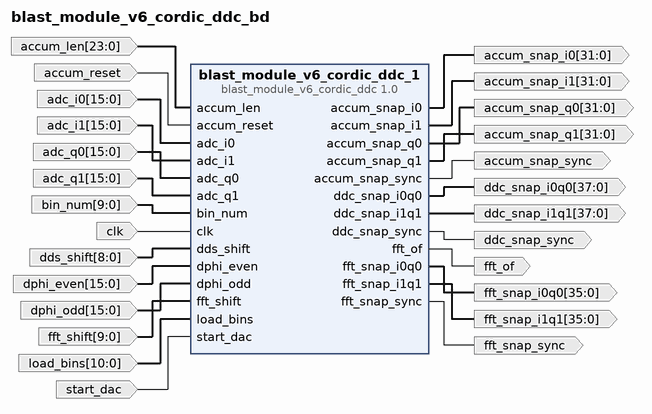
[diagram p0: block diagram of the top level]
# Vivado block design blast_module_v6_cordic_ddc_bd, xczu28dr-ffvg1517-2-e, Vivado 2020.2
create_bd_design blast_module_v6_cordic_ddc_bd

create_bd_port -dir I -from 23 -to 0 -type data accum_len
create_bd_port -dir I -type rst accum_reset
create_bd_port -dir O -from 31 -to 0 -type data accum_snap_i0
create_bd_port -dir O -from 31 -to 0 -type data accum_snap_i1
create_bd_port -dir O -from 31 -to 0 -type data accum_snap_q0
create_bd_port -dir O -from 31 -to 0 -type data accum_snap_q1
create_bd_port -dir O -type data accum_snap_sync
create_bd_port -dir I -from 15 -to 0 -type data adc_i0
create_bd_port -dir I -from 15 -to 0 -type data adc_i1
create_bd_port -dir I -from 15 -to 0 -type data adc_q0
create_bd_port -dir I -from 15 -to 0 -type data adc_q1
create_bd_port -dir I -from 9 -to 0 -type data bin_num
create_bd_port -dir I -type clk clk
create_bd_port -dir O -from 37 -to 0 -type data ddc_snap_i0q0
create_bd_port -dir O -from 37 -to 0 -type data ddc_snap_i1q1
create_bd_port -dir O -type data ddc_snap_sync
create_bd_port -dir I -from 8 -to 0 -type data dds_shift
create_bd_port -dir I -from 15 -to 0 -type data dphi_even
create_bd_port -dir I -from 15 -to 0 -type data dphi_odd
create_bd_port -dir O -type data fft_of
create_bd_port -dir I -from 9 -to 0 -type data fft_shift
create_bd_port -dir O -from 35 -to 0 -type data fft_snap_i0q0
create_bd_port -dir O -from 35 -to 0 -type data fft_snap_i1q1
create_bd_port -dir O -type data fft_snap_sync
create_bd_port -dir I -from 10 -to 0 -type data load_bins
create_bd_port -dir I -type data start_dac

create_bd_cell -type ip -vlnv User_Company:SysGen:blast_module_v6_cordic_ddc:1.0 blast_module_v6_cordic_ddc_1

# ---- connections ----

connect_bd_net [get_bd_ports accum_len] [get_bd_pins blast_module_v6_cordic_ddc_1/accum_len]
connect_bd_net [get_bd_ports accum_reset] [get_bd_pins blast_module_v6_cordic_ddc_1/accum_reset]
connect_bd_net [get_bd_pins blast_module_v6_cordic_ddc_1/accum_snap_i0] [get_bd_ports accum_snap_i0]
connect_bd_net [get_bd_pins blast_module_v6_cordic_ddc_1/accum_snap_i1] [get_bd_ports accum_snap_i1]
connect_bd_net [get_bd_pins blast_module_v6_cordic_ddc_1/accum_snap_q0] [get_bd_ports accum_snap_q0]
connect_bd_net [get_bd_pins blast_module_v6_cordic_ddc_1/accum_snap_q1] [get_bd_ports accum_snap_q1]
connect_bd_net [get_bd_pins blast_module_v6_cordic_ddc_1/accum_snap_sync] [get_bd_ports accum_snap_sync]
connect_bd_net -net adc_i0_1 [get_bd_ports adc_i0] [get_bd_pins blast_module_v6_cordic_ddc_1/adc_i0]
connect_bd_net -net adc_i1_1 [get_bd_ports adc_i1] [get_bd_pins blast_module_v6_cordic_ddc_1/adc_i1]
connect_bd_net -net adc_q0_1 [get_bd_ports adc_q0] [get_bd_pins blast_module_v6_cordic_ddc_1/adc_q0]
connect_bd_net -net adc_q1_1 [get_bd_ports adc_q1] [get_bd_pins blast_module_v6_cordic_ddc_1/adc_q1]
connect_bd_net [get_bd_ports bin_num] [get_bd_pins blast_module_v6_cordic_ddc_1/bin_num]
connect_bd_net [get_bd_ports clk] [get_bd_pins blast_module_v6_cordic_ddc_1/clk]
connect_bd_net [get_bd_pins blast_module_v6_cordic_ddc_1/ddc_snap_i0q0] [get_bd_ports ddc_snap_i0q0]
connect_bd_net [get_bd_pins blast_module_v6_cordic_ddc_1/ddc_snap_i1q1] [get_bd_ports ddc_snap_i1q1]
connect_bd_net [get_bd_pins blast_module_v6_cordic_ddc_1/ddc_snap_sync] [get_bd_ports ddc_snap_sync]
connect_bd_net [get_bd_ports dds_shift] [get_bd_pins blast_module_v6_cordic_ddc_1/dds_shift]
connect_bd_net [get_bd_ports dphi_even] [get_bd_pins blast_module_v6_cordic_ddc_1/dphi_even]
connect_bd_net [get_bd_ports dphi_odd] [get_bd_pins blast_module_v6_cordic_ddc_1/dphi_odd]
connect_bd_net [get_bd_pins blast_module_v6_cordic_ddc_1/fft_of] [get_bd_ports fft_of]
connect_bd_net [get_bd_ports fft_shift] [get_bd_pins blast_module_v6_cordic_ddc_1/fft_shift]
connect_bd_net [get_bd_pins blast_module_v6_cordic_ddc_1/fft_snap_i0q0] [get_bd_ports fft_snap_i0q0]
connect_bd_net [get_bd_pins blast_module_v6_cordic_ddc_1/fft_snap_i1q1] [get_bd_ports fft_snap_i1q1]
connect_bd_net [get_bd_pins blast_module_v6_cordic_ddc_1/fft_snap_sync] [get_bd_ports fft_snap_sync]
connect_bd_net [get_bd_ports load_bins] [get_bd_pins blast_module_v6_cordic_ddc_1/load_bins]
connect_bd_net [get_bd_ports start_dac] [get_bd_pins blast_module_v6_cordic_ddc_1/start_dac]

validate_bd_design
save_bd_design
